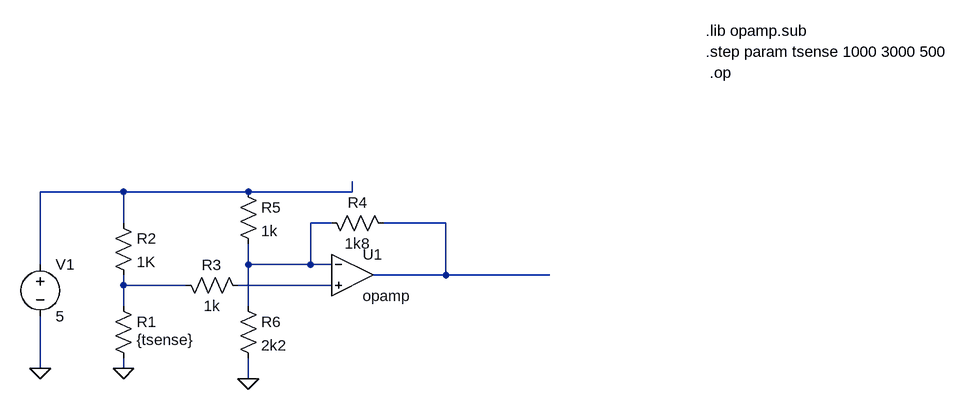
[diagram p0: schematic FlameSensor.asc]
FlameSensor.asc, the LTspice schematic file:
Version 4
SHEET 1 1444 680
WIRE 144 0 16 0
WIRE 336 0 144 0
WIRE 496 0 496 -16
WIRE 496 0 336 0
WIRE 144 48 144 0
WIRE 464 48 432 48
WIRE 640 48 544 48
WIRE 16 112 16 0
WIRE 336 112 336 80
WIRE 432 112 432 48
WIRE 432 112 336 112
WIRE 464 112 432 112
WIRE 640 128 640 48
WIRE 640 128 528 128
WIRE 800 128 640 128
WIRE 144 144 144 128
WIRE 240 144 144 144
WIRE 464 144 320 144
WIRE 144 176 144 144
WIRE 336 176 336 112
WIRE 16 272 16 192
WIRE 144 272 144 256
WIRE 336 288 336 256
FLAG 144 272 0
FLAG 16 272 0
FLAG 336 288 0
SYMBOL res 128 160 R0
WINDOW 3 36 68 Left 2
SYMATTR InstName R1
SYMATTR Value {tsense}
SYMBOL res 128 32 R0
SYMATTR InstName R2
SYMATTR Value 1K
SYMBOL voltage 16 96 R0
WINDOW 123 0 0 Left 0
WINDOW 39 0 0 Left 0
SYMATTR InstName V1
SYMATTR Value 5
SYMBOL res 224 128 M90
WINDOW 0 0 56 VBottom 2
WINDOW 3 32 56 VTop 2
SYMATTR InstName R3
SYMATTR Value 1k
SYMBOL res 448 32 M90
WINDOW 0 0 56 VBottom 2
WINDOW 3 32 56 VTop 2
SYMATTR InstName R4
SYMATTR Value 1k8
SYMBOL res 320 -16 R0
SYMATTR InstName R5
SYMATTR Value 1k
SYMBOL res 320 160 R0
SYMATTR InstName R6
SYMATTR Value 2k2
SYMBOL OpAmps\\opamp 496 64 R0
SYMATTR InstName U1
TEXT 1040 -216 Left 2 !.step param tsense 1000 3000 500
TEXT 1046 -184 Left 2 !.op
TEXT 1040 -248 Left 2 !.lib opamp.sub

The netlist it stands for:
* FlameSensor.asc
R1 N004 0 {tsense}
R2 N001 N004 1K
V1 N001 0 5
R3 N004 N005 1k
R4 N002 N003 1k8
R5 N001 N002 1k
R6 N002 0 2k2
XU1 N002 N005 N003 opamp Aol=100K GBW=10Meg  ; pins invin noninvin out
.step param tsense 1000 3000 500
.op
.lib opamp.sub
.backanno
.end